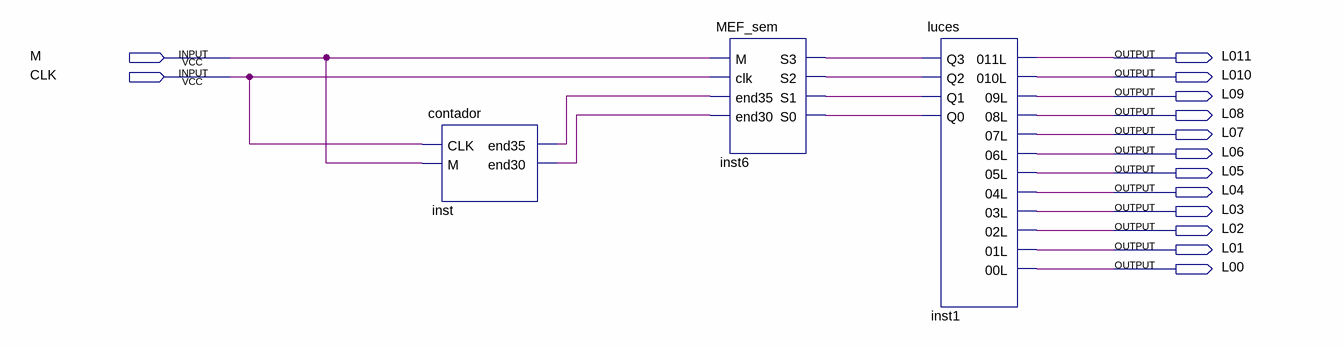
[diagram p0: schematic sheet]
// Quartus schematic TE2_Grupo17.bdf as structural Verilog: 3 symbols, 14 pins
module TE2_Grupo17 (
  input  M,
  input  CLK,
  output L011,
  output L010,
  output L09,
  output L08,
  output L07,
  output L06,
  output L05,
  output L04,
  output L03,
  output L02,
  output L01,
  output L00
);

  wire inst6_s0, inst6_s1, inst6_s2, inst6_s3, inst_end30, inst_end35;

  contador inst (.CLK(CLK), .M(M), .end35(inst_end35), .end30(inst_end30));
  MEF_sem inst6 (
    .M(M), .clk(CLK), .end35(inst_end35), .end30(inst_end30), .S3(inst6_s3), .S2(inst6_s2), .S1(inst6_s1),
    .S0(inst6_s0));
  luces inst1 (
    .Q3(inst6_s3), .Q2(inst6_s2), .Q1(inst6_s1), .Q0(inst6_s0), .\011L (L011), .\010L (L010), .\09L (L09),
    .\08L (L08), .\07L (L07), .\06L (L06), .\05L (L05), .\04L (L04), .\03L (L03), .\02L (L02), .\01L (L01),
    .\00L (L00));
endmodule
